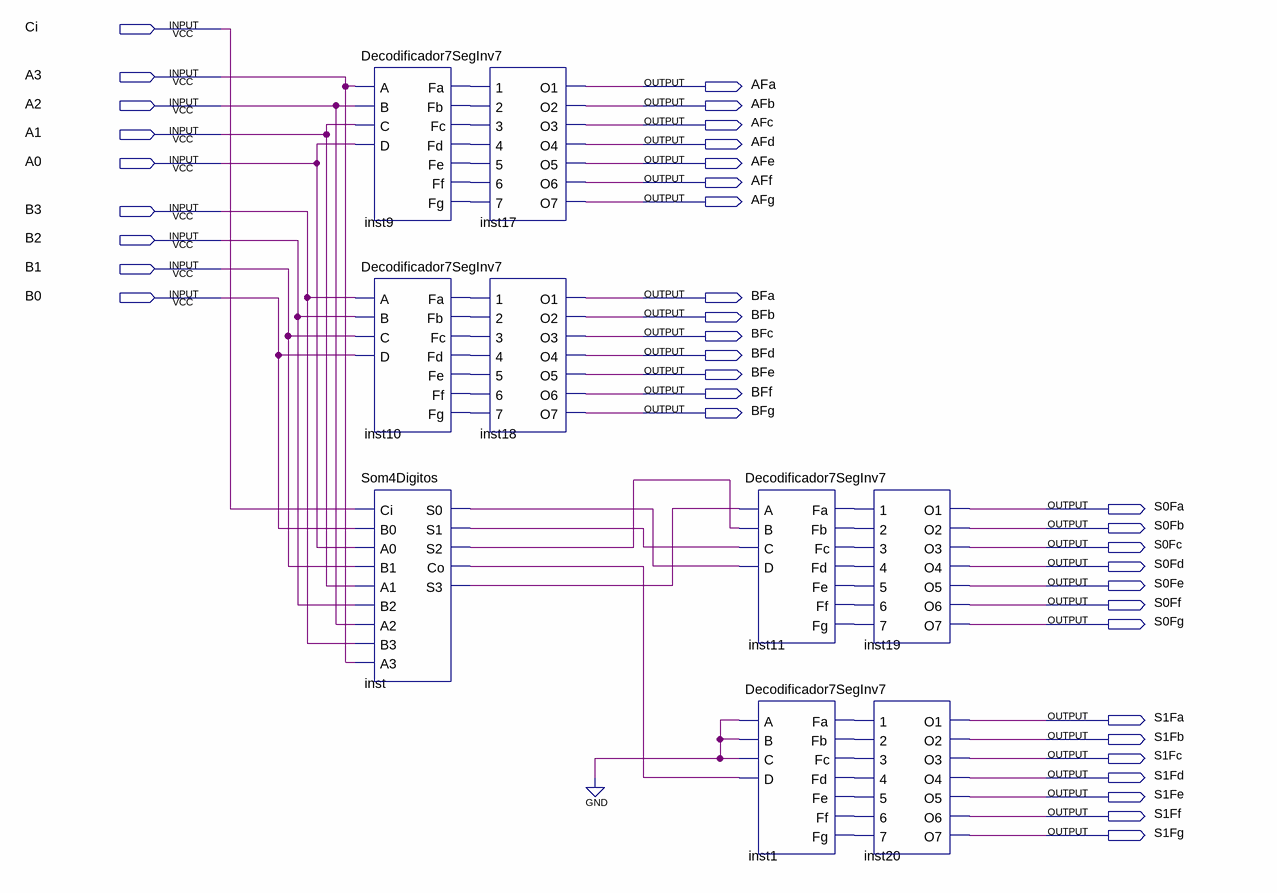
[diagram p0: schematic sheet]
// Quartus schematic Lab1.bdf as structural Verilog: 9 symbols, 37 pins
module Lab1 (
  input  Ci,
  input  A3,
  input  A2,
  input  A1,
  input  A0,
  input  B3,
  input  B2,
  input  B1,
  input  B0,
  output AFa,
  output AFb,
  output AFc,
  output AFd,
  output AFe,
  output AFf,
  output AFg,
  output BFa,
  output BFb,
  output BFc,
  output BFd,
  output BFe,
  output BFf,
  output BFg,
  output S0Fa,
  output S0Fb,
  output S0Fc,
  output S0Fd,
  output S0Fe,
  output S0Ff,
  output S0Fg,
  output S1Fa,
  output S1Fb,
  output S1Fc,
  output S1Fd,
  output S1Fe,
  output S1Ff,
  output S1Fg
);

  wire inst1_fa, inst1_fb, inst1_fc, inst1_fd, inst1_fe, inst1_ff, inst1_fg, inst9_fa, inst9_fb, inst9_fc,
       inst9_fd, inst9_fe, inst9_ff, inst9_fg, inst10_fa, inst10_fb, inst10_fc, inst10_fd, inst10_fe,
       inst10_ff, inst10_fg, inst11_fa, inst11_fb, inst11_fc, inst11_fd, inst11_fe, inst11_ff, inst11_fg,
       inst_co, inst_s0, inst_s1, inst_s2, inst_s3;

  Decodificador7Seg inst9 (
    .A(A3), .B(A2), .C(A1), .D(A0), .Fa(inst9_fa), .Fb(inst9_fb), .Fc(inst9_fc), .Fd(inst9_fd),
    .Fe(inst9_fe), .Ff(inst9_ff), .Fg(inst9_fg));
  Decodificador7Seg inst10 (
    .A(B3), .B(B2), .C(B1), .D(B0), .Fa(inst10_fa), .Fb(inst10_fb), .Fc(inst10_fc), .Fd(inst10_fd),
    .Fe(inst10_fe), .Ff(inst10_ff), .Fg(inst10_fg));
  Som4Digitos inst (
    .Ci(Ci), .B0(B0), .A0(A0), .B1(B1), .A1(A1), .B2(B2), .A2(A2), .B3(B3), .A3(A3), .S0(inst_s0),
    .S1(inst_s1), .S2(inst_s2), .Co(inst_co), .S3(inst_s3));
  Inv7 inst17 (
    .\1 (inst9_fa), .\2 (inst9_fb), .\3 (inst9_fc), .\4 (inst9_fd), .\5 (inst9_fe), .\6 (inst9_ff),
    .\7 (inst9_fg), .O1(AFa), .O2(AFb), .O3(AFc), .O4(AFd), .O5(AFe), .O6(AFf), .O7(AFg));
  Inv7 inst18 (
    .\1 (inst10_fa), .\2 (inst10_fb), .\3 (inst10_fc), .\4 (inst10_fd), .\5 (inst10_fe), .\6 (inst10_ff),
    .\7 (inst10_fg), .O1(BFa), .O2(BFb), .O3(BFc), .O4(BFd), .O5(BFe), .O6(BFf), .O7(BFg));
  Decodificador7Seg inst11 (
    .A(inst_s3), .B(inst_s2), .C(inst_s1), .D(inst_s0), .Fa(inst11_fa), .Fb(inst11_fb), .Fc(inst11_fc),
    .Fd(inst11_fd), .Fe(inst11_fe), .Ff(inst11_ff), .Fg(inst11_fg));
  Decodificador7Seg inst1 (
    .A(1'b0), .B(1'b0), .C(1'b0), .D(inst_co), .Fa(inst1_fa), .Fb(inst1_fb), .Fc(inst1_fc), .Fd(inst1_fd),
    .Fe(inst1_fe), .Ff(inst1_ff), .Fg(inst1_fg));
  Inv7 inst19 (
    .\1 (inst11_fa), .\2 (inst11_fb), .\3 (inst11_fc), .\4 (inst11_fd), .\5 (inst11_fe), .\6 (inst11_ff),
    .\7 (inst11_fg), .O1(S0Fa), .O2(S0Fb), .O3(S0Fc), .O4(S0Fd), .O5(S0Fe), .O6(S0Ff), .O7(S0Fg));
  Inv7 inst20 (
    .\1 (inst1_fa), .\2 (inst1_fb), .\3 (inst1_fc), .\4 (inst1_fd), .\5 (inst1_fe), .\6 (inst1_ff),
    .\7 (inst1_fg), .O1(S1Fa), .O2(S1Fb), .O3(S1Fc), .O4(S1Fd), .O5(S1Fe), .O6(S1Ff), .O7(S1Fg));
endmodule
